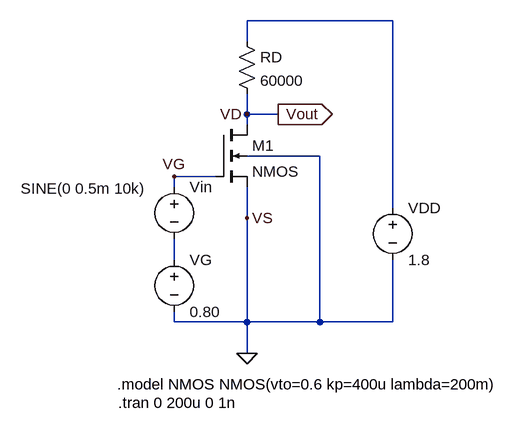
[diagram p0: schematic HW3 1-a.asc]
HW3 1-a.asc, the LTspice schematic file:
Version 4
SHEET 1 880 680
WIRE 464 -96 240 -96
WIRE 240 -64 240 -96
WIRE 240 48 240 16
WIRE 288 48 240 48
WIRE 240 64 240 48
WIRE 352 112 240 112
WIRE 192 144 128 144
WIRE 128 160 128 144
WIRE 464 192 464 -96
WIRE 240 208 240 160
WIRE 128 272 128 240
WIRE 128 368 128 352
WIRE 240 368 240 208
WIRE 240 368 128 368
WIRE 352 368 352 112
WIRE 352 368 240 368
WIRE 464 368 464 272
WIRE 464 368 352 368
WIRE 240 416 240 368
FLAG 240 416 0
FLAG 288 48 Vout
IOPIN 288 48 Out
FLAG 240 48 VD
FLAG 128 144 VG
FLAG 240 208 VS
SYMBOL nmos4 192 64 R0
SYMATTR InstName M1
SYMATTR Value2 l=0.18u w=0.25u
SYMBOL voltage 464 176 R0
SYMATTR InstName VDD
SYMATTR Value 1.8
SYMBOL res 224 -80 R0
SYMATTR InstName RD
SYMATTR Value 60000
SYMBOL voltage 128 256 R0
WINDOW 123 0 0 Left 0
WINDOW 39 0 0 Left 0
SYMATTR InstName VG
SYMATTR Value 0.80
SYMBOL voltage 128 144 R0
WINDOW 3 -236 18 Left 2
WINDOW 123 0 0 Left 0
WINDOW 39 0 0 Left 0
SYMATTR InstName Vin
SYMATTR Value SINE(0 0.5m 10k)
TEXT 40 464 Left 2 !.model NMOS NMOS(vto=0.6 kp=400u lambda=200m)
TEXT 42 492 Left 2 !.tran 0 200u 0 1n

The netlist it stands for:
* HW3 1-a.asc
M1 VD VG 0 0 NMOS l=0.18u w=0.25u
VDD N001 0 1.8
RD N001 VD 60000
VG N002 0 0.80
Vin VG N002 SINE(0 0.5m 10k)
.model NMOS NMOS
.model PMOS PMOS
.lib standard.mos
.model NMOS NMOS(vto=0.6 kp=400u lambda=200m)
.tran 0 200u 0 1n
.backanno
.end